# EAGLE design Arduino MEGA Reference Design (EAGLE 5.04)
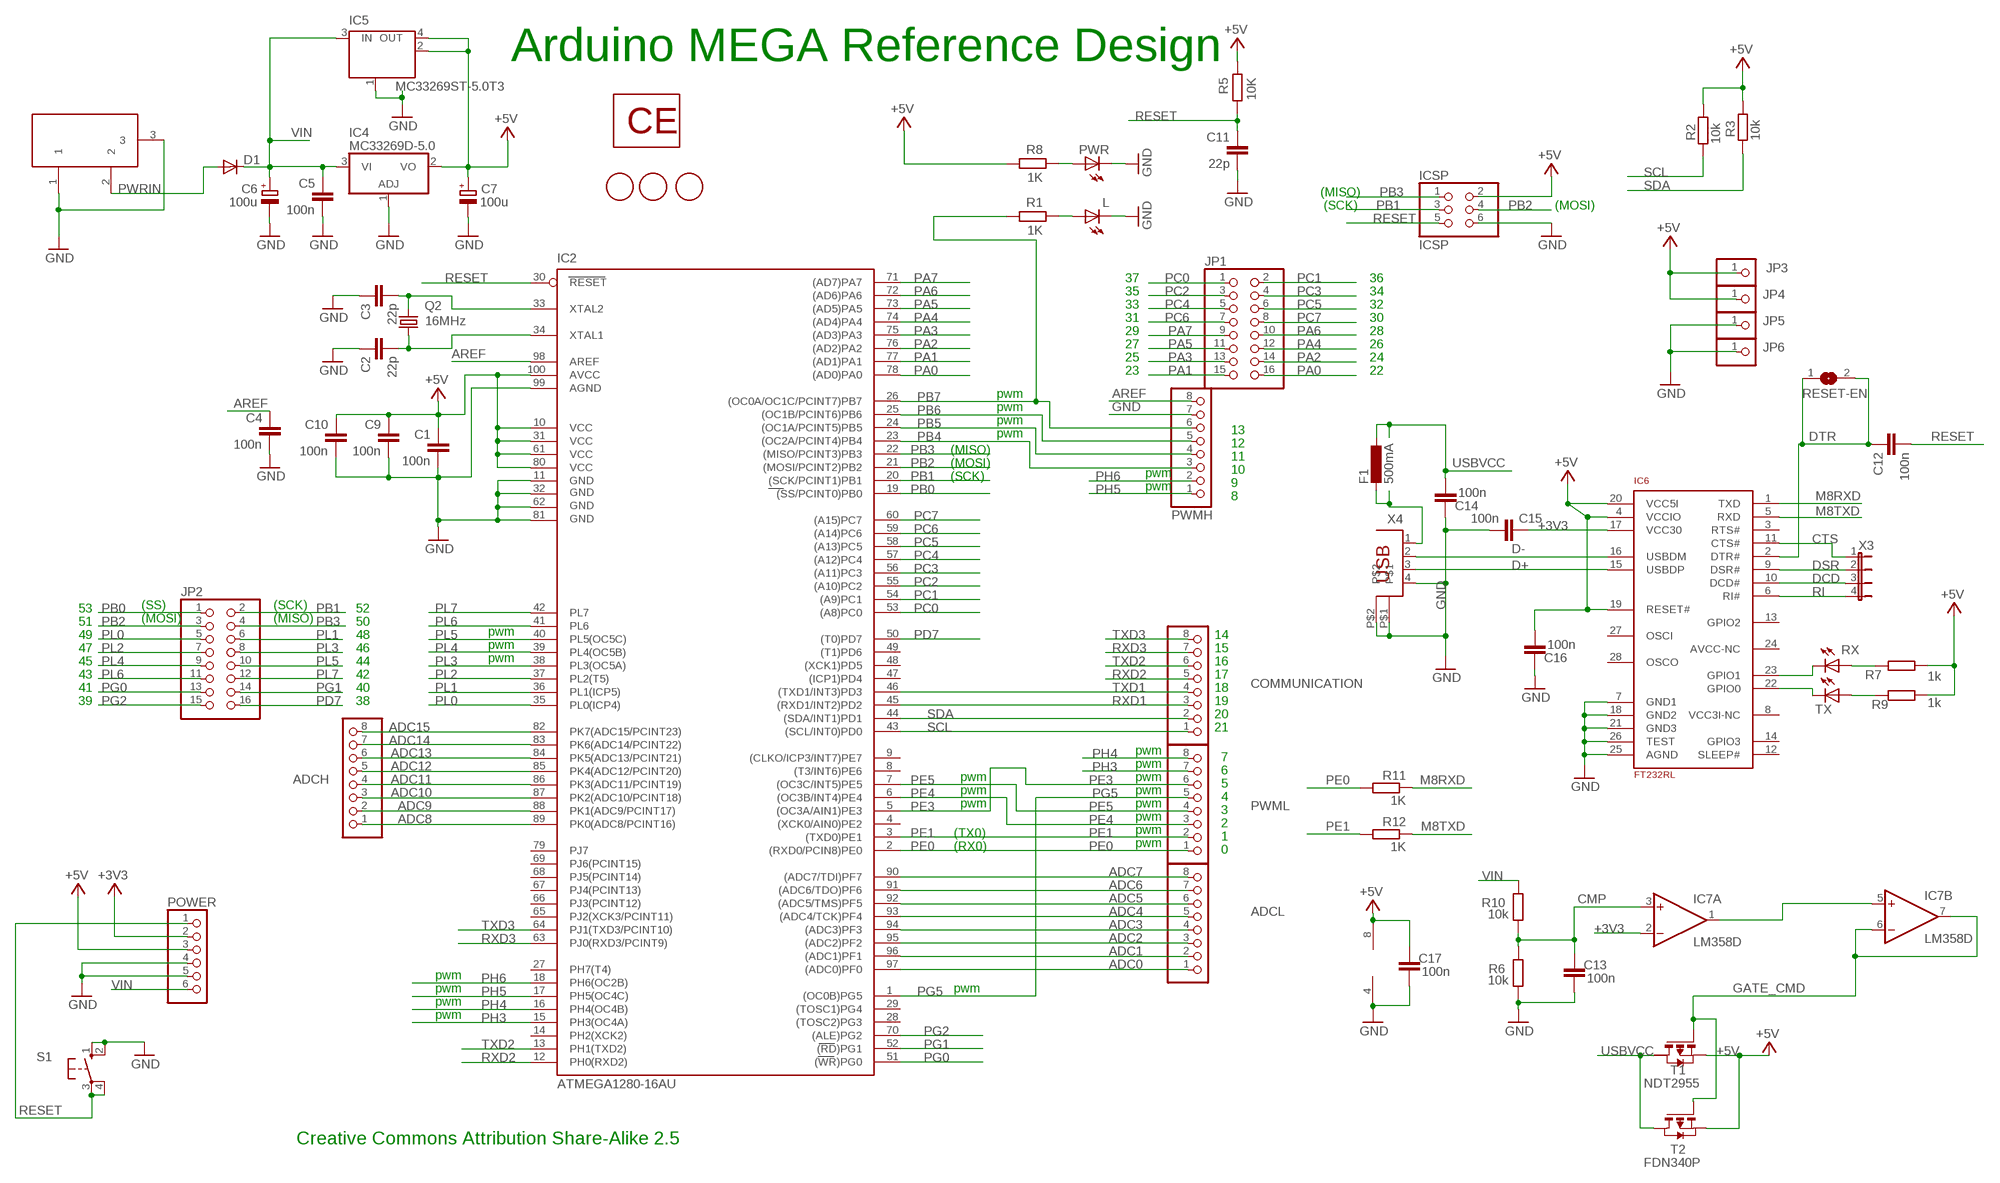
[diagram p0: schematic, sheet 1]

## Parts
ADCH  PINHD-1X8  [1X08]
ADCL  PINHD-1X8  [1X08]
C1  100n  C-EU  [C0805RND]
C2  22p  C-EU  [C0805RND]
C3  22p  C-EU  [C0805RND]
C4  100n  C-EU  [C0805RND]
C5  100n  C-EU  [C0805RND]
C6  100u  CPOL-EUSMCD  [SMC_D]
C7  100u  CPOL-EUSMCD  [SMC_D]
C9  100n  C-EU  [C0805RND]
C10  100n  C-EU  [C0805RND]
C11  22p  C-EU  [C0805RND]
C12  100n  C-EU  [C0805RND]
C13  100n  C-EU  [C0805RND]
C14  100n  C-EU  [C0805RND]
C15  100n  C-EU  [C0805RND]
C16  100n  C-EU  [C0805RND]
C17  100n  C-EU  [C0805RND]
COMMUNICATION  PINHD-1X8  [1X08]
D1  DIODE-SMB  [SMB]
F1  500mA  L-EUL1812  [L1812]
IC2  ATMEGA1280-16AU  [TQFP100]
IC4  MC33269D-5.0  [DPACK]
IC5  MC33269ST-5.0T3  MC33269ST-3.3T3  [SOT223]
IC6  FT232RL  [SSOP28]
IC7  LM358D  [SO08]
ICSP  ICSP  PINHD-2X3  [2X03]
JP1  PINHD-2X8  [2X08]
JP2  PINHD-2X8  [2X08]
JP3  PINHD-1X1  [1X01]
JP4  PINHD-1X1  [1X01]
JP5  PINHD-1X1  [1X01]
JP6  PINHD-1X1  [1X01]
L  LED0805ROUND  [0805RND]
POWER  PINHD-1X6  [1X06]
PWMH  PINHD-1X8  [1X08]
PWML  PINHD-1X8  [1X08]
PWR  LED0805ROUND  [0805RND]
Q2  16MHz  CRYTALHC49S  [HC49/S]
R1  1K  R-EU_  [R0805RND]
R2  10k  R-EU_  [R0805RND]
R3  10k  R-EU_  [R0805RND]
R5  10K  R-EU_  [R0805RND]
R6  10k  R-EU_  [R0805RND]
R7  1k  R-EU_  [R0805RND]
R8  1K  R-EU_  [R0805RND]
R9  1k  R-EU_  [R0805RND]
R10  10k  R-EU_  [R0805RND]
R11  1K  R-EU_  [RCL_0805RND]
R12  1K  R-EU_  [RCL_0805RND]
RESET-EN  SJ  [SJ]
RX  LED0805ROUND  [0805RND]
S1  10-XX  [B3F-10XX]
T1  NDT2955  PMOSSOT223  [SOT223]
T2  FDN340P  PMOSSOT23  [SOT-23]
TX  LED0805ROUND  [0805RND]
U$1  FIDUCIALMOUNT  [FIDUCIA-MOUNT]
U$2  FIDUCIALMOUNT  [FIDUCIA-MOUNT]
U$3  FIDUCIALMOUNT  [FIDUCIA-MOUNT]
U$4  CE  [CE-COPPER]
X2  DC21MMX  [DC-21MM]
X3  JP4E  [JP4]
X4  PN61729  [PN61729]

## Nets
+3V3 [power]: C15.2 IC6.17(VCC30) IC7.2(A:-IN) POWER.2
+5V [usbvcc]: C1.1 C7.+ C9.1 C10.1 C16.1 C17.2 IC2.10(VCC) IC2.31(VCC1) IC2.61(VCC2) IC2.80(VCC3) IC2.100(AVCC) IC4.2(VO) IC5.2(OUT) IC5.4(OUT) IC6.4(VCCIO) IC6.19(RESET#) IC6.20(VCC5I) IC7.8(P:V+) ICSP.2 JP3.1 JP4.1 POWER.3 R2.1 R3.1 R5.2 R7.2 R8.1 R9.2 T1.3(S) T2.2(S)
ADC0: ADCL.1 IC2.97((ADC0)PF0)
ADC1: ADCL.2 IC2.96((ADC1)PF1)
ADC2: ADCL.3 IC2.95((ADC2)PF2)
ADC3: ADCL.4 IC2.94((ADC3)PF3)
ADC4: ADCL.5 IC2.93((ADC4/TCK)PF4)
ADC5: ADCL.6 IC2.92((ADC5/TMS)PF5)
ADC6: ADCL.7 IC2.91((ADC6/TDO)PF6)
ADC7: ADCL.8 IC2.90((ADC7/TDI)PF7)
ADC8: ADCH.1 IC2.89(PK0(ADC8/PCINT16))
ADC9: ADCH.2 IC2.88(PK1(ADC9/PCINT17))
ADC10: ADCH.3 IC2.87(PK2(ADC10/PCINT18))
ADC11: ADCH.4 IC2.86(PK3(ADC11/PCINT19))
ADC12: ADCH.5 IC2.85(PK4(ADC12/PCINT20))
ADC13: ADCH.6 IC2.84(PK5(ADC13/PCINT21))
ADC14: ADCH.7 IC2.83(PK6(ADC14/PCINT22))
ADC15: ADCH.8 IC2.82(PK7(ADC15/PCINT23))
AREF: C4.1 IC2.98(AREF) PWMH.8
CMP: C13.2 IC7.3(A:+IN) R6.2 R10.1
CTS: IC6.11(CTS#) X3.1
D+: IC6.15(USBDP) X4.3
D-: IC6.16(USBDM) X4.2
DCD: IC6.10(DCD#) X3.3
DSR: IC6.9(DSR#) X3.2
DTR: C12.1 IC6.2(DTR#) RESET-EN.1 RESET-EN.2
GATE_CMD: IC7.6(B:-IN) IC7.7(B:OUT) T1.1(G) T2.3(G)
GND [gnd]: C1.2 C2.1 C3.1 C4.2 C5.2 C6.- C7.- C9.2 C10.2 C11.2 C13.1 C14.2 C15.1 C16.2 C17.1 IC2.11(GND) IC2.32(GND1) IC2.62(GND2) IC2.81(GND3) IC2.99(AGND) IC4.1(ADJ) IC5.1(GND/ADJ) IC6.7(GND1) IC6.18(GND2) IC6.21(GND3) IC6.25(AGND) IC6.26(TEST) IC7.4(P:V-) ICSP.6 JP5.1 JP6.1 L.P$2(C) POWER.4 POWER.5 PWMH.7 PWR.P$2(C) R6.1 S1.1(S) S1.2(S1) X2.1 X2.3 X4.4 X4.P$1 X4.P$2
M8RXD: IC6.1(TXD) R11.P$1
M8TXD: IC6.5(RXD) R12.P$1
N$2: L.P$1(A) R1.2
N$3: PWR.P$1(A) R8.2
N$4: IC7.1(A:OUT) IC7.5(B:+IN)
N$6: C2.2 IC2.34(XTAL1) Q2.1
N$7: C3.2 IC2.33(XTAL2) Q2.2
N$15: IC6.23(GPIO1) RX.P$2(C)
N$53: IC6.22(GPIO0) TX.P$2(C)
N$54: R7.1 RX.P$1(A)
N$55: R9.1 TX.P$1(A)
N$60 [usbvcc]: F1.2 X4.1
PA0: IC2.78((AD0)PA0) JP1.16
PA1: IC2.77((AD1)PA1) JP1.15
PA2: IC2.76((AD2)PA2) JP1.14
PA3: IC2.75((AD3)PA3) JP1.13
PA4: IC2.74((AD4)PA4) JP1.12
PA5: IC2.73((AD5)PA5) JP1.11
PA6: IC2.72((AD6)PA6) JP1.10
PA7: IC2.71((AD7)PA7) JP1.9
PB0: IC2.19((SS/PCINT0)PB0) JP2.1
PB1: IC2.20((SCK/PCINT1)PB1) ICSP.3 JP2.2
PB2: IC2.21((MOSI/PCINT2)PB2) ICSP.4 JP2.3
PB3: IC2.22((MISO/PCINT3)PB3) ICSP.1 JP2.4
PB4: IC2.23((OC2A/PCINT4)PB4) PWMH.3
PB5: IC2.24((OC1A/PCINT5)PB5) PWMH.4
PB6: IC2.25((OC1B/PCINT6)PB6) PWMH.5
PB7: IC2.26((OC0A/OC1C/PCINT7)PB7) PWMH.6 R1.1
PC0: IC2.53((A8)PC0) JP1.1
PC1: IC2.54((A9)PC1) JP1.2
PC2: IC2.55((A10)PC2) JP1.3
PC3: IC2.56((A11)PC3) JP1.4
PC4: IC2.57((A12)PC4) JP1.5
PC5: IC2.58((A13)PC5) JP1.6
PC6: IC2.59((A14)PC6) JP1.7
PC7: IC2.60((A15)PC7) JP1.8
PD7: IC2.50((T0)PD7) JP2.16
PE0: IC2.2((RXD0/PCIN8)PE0) PWML.1 R11.P$2
PE1: IC2.3((TXD0)PE1) PWML.2 R12.P$2
PE3: IC2.5((OC3A/AIN1)PE3) PWML.6
PE4: IC2.6((OC3B/INT4)PE4) PWML.3
PE5: IC2.7((OC3C/INT5)PE5) PWML.4
PG0: IC2.51((WR)PG0) JP2.13
PG1: IC2.52((RD)PG1) JP2.14
PG2: IC2.70((ALE)PG2) JP2.15
PG5: IC2.1((OC0B)PG5) PWML.5
PH3: IC2.15(PH3(OC4A)) PWML.7
PH4: IC2.16(PH4(OC4B)) PWML.8
PH5: IC2.17(PH5(OC4C)) PWMH.1
PH6: IC2.18(PH6(OC2B)) PWMH.2
PL0: IC2.35(PL0(ICP4)) JP2.5
PL1: IC2.36(PL1(ICP5)) JP2.6
PL2: IC2.37(PL2(T5)) JP2.7
PL3: IC2.38(PL3(OC5A)) JP2.8
PL4: IC2.39(PL4(OC5B)) JP2.9
PL5: IC2.40(PL5(OC5C)) JP2.10
PL6: IC2.41(PL6) JP2.11
PL7: IC2.42(PL7) JP2.12
PWRIN [power]: D1.A X2.2
RESET: C11.1 C12.2 IC2.30(RESET) ICSP.5 POWER.1 R5.1 S1.3(P) S1.4(P1)
RI: IC6.6(RI#) X3.4
RXD1: COMMUNICATION.3 IC2.45((RXD1/INT2)PD2)
RXD2: COMMUNICATION.5 IC2.12(PH0(RXD2))
RXD3: COMMUNICATION.7 IC2.63(PJ0(RXD3/PCINT9))
SCL: COMMUNICATION.1 IC2.43((SCL/INT0)PD0) R2.2
SDA: COMMUNICATION.2 IC2.44((SDA/INT1)PD1) R3.2
TXD1: COMMUNICATION.4 IC2.46((TXD1/INT3)PD3)
TXD2: COMMUNICATION.6 IC2.13(PH1(TXD2))
TXD3: COMMUNICATION.8 IC2.64(PJ1(TXD3/PCINT10))
USBVCC [usbvcc]: C14.1 F1.1 T1.2(D) T2.1(D)
VIN [power]: C5.1 C6.+ D1.C IC4.3(VI) IC5.3(IN) POWER.6 R10.2
Unconnected: IC2.4((XCK0/AIN0)PE2) IC2.8((T3/INT6)PE6) IC2.9((CLKO/ICP3/INT7)PE7) IC2.14(PH2(XCK2)) IC2.27(PH7(T4)) IC2.28((TOSC2)PG3) IC2.29((TOSC1)PG4) IC2.47((ICP1)PD4) IC2.48((XCK1)PD5) IC2.49((T1)PD6) IC2.65(PJ2(XCK3/PCINT11)) IC2.66(PJ3(PCINT12)) IC2.67(PJ4(PCINT13)) IC2.68(PJ5(PCINT14)) IC2.69(PJ6(PCINT15)) IC2.79(PJ7) IC6.3(RTS#) IC6.8(VCC3I-NC) IC6.12(SLEEP#) IC6.13(GPIO2) IC6.14(GPIO3) IC6.24(AVCC-NC) IC6.27(OSCI) IC6.28(OSCO) T1.4(D2)

## Notes on the sheet
- Arduino MEGA Reference Design
- (MISO)
- (SCK) | (MOSI)
- 37 | 36
- 35 | 34
- 33 | 32
- 31 | 30
- 29 | 28
- 27 | 26
- 25 | 24
- 23 | 22
- pwm
- pwm
- pwm
- pwm | 13
- 12
- (MISO)
- 11
- (MOSI)
- pwm | 10
- (SCK)
- pwm | 9
- 8
- 53 | (SS) | (SCK) | 52
- 51 | (MOSI) | (MISO) | 50
- 49 | 48 | pwm | 14
- 47 | 46 | pwm | 15
- 45 | 44 | pwm | 16
- 43 | 42 | 17
- 41 | 40 | 18
- 39 | 38 | 19
- 20
- 21
- pwm
- 7
- pwm
- 6
- pwm | pwm
- 5
- pwm | pwm
- 4
- pwm | pwm
- 3
- pwm
- 2
- (TX0) | pwm
- 1
- (RX0) | pwm
- 0
- pwm
- pwm | pwm
- pwm
- pwm
- Creative Commons Attribution Share-Alike 2.5

## Library data of the parts
ADCH ADCL COMMUNICATION PWMH PWML = pinhead:PINHD-1X8: PIN HEADER
C1-C5 C9-C17 = rcl:C-EU: CAPACITOR, European symbol
C6 C7 = rcl:CPOL-EU: POLARIZED CAPACITOR, European symbol
D1 = diode:DIODE-: DIODE
F1 = rcl:L-EU: INDUCTOR, European symbol
IC2 = atmel-2005:ATMEGA*: MICROCONTROLLER 64/128/256 Kbytes FLASH 4 Kbytes EEPROM 8 Kbytes SRAM 86 General Purpose I/O pins 12-channels16-bit PWM 4 x Serial USARTs 16-channels 10-bit A/D
IC4 = linear:MC33269?*: Adjustable Output Low Dropout Voltage Regulator 800 mA Source: http://www.onsemi.com/pub/Collateral/MC33269-D.PDF
IC5 = linear:MC33269ST*: Adjustable Output Low Dropout Voltage Regulator 800 mA Source: http://www.onsemi.com/pub/Collateral/MC33269-D.PDF
IC6 = SmartPrj:FT232RL
IC7 = linear:LM358: OP AMP also LM158; LM258; LM2904 Source: http://cache.national.com/ds/LM/LM158.pdf
ICSP = pinhead:PINHD-2X3: PIN HEADER
JP1 JP2 = pinhead:PINHD-2X8: PIN HEADER
JP3-JP6 = pinhead:PINHD-1X1: PIN HEADER
L PWR RX TX = led:LED: LED OSRAM: - CHIPLED LG R971, LG N971, LY N971, LG Q971, LY Q971, LO R971, LY R971 LH N974, LH R974 LS Q976, LO Q976, LY Q976 LO Q996 - Hyper CHIPLED LW Q18S LB Q993, LB Q99A, LB R99A - SideLED LS A670, LO A670, LY A670, LG A670, LP A670 LB A673, LV A673, LT A673, LW A673 LH A674 LY A675 LS A676, LA A676, LO A676, LY A676, LW A676 LS A679, LY A679, LG A679 - Hyper Micro SIDELED® LS Y876, LA Y876, LO Y876, LY Y876 LT Y87S - SmartLED LW L88C, LW L88S LB L89C, LB L89S, LG L890 LS L89K, LO L89K, LY L89K LS L896, LA L896, LO L896, LY L896 - TOPLED LS T670, LO T670, LY T670, LG T670, LP T670 LSG T670, LSP T670, LSY T670, LOP T670, LYG T670 LG T671, LOG T671, LSG T671 LB T673, LV T673, LT T673, LW T673 LH T674 LS T676, LA T676, LO T676, LY T676, LB T676, LH T676, LSB T676, LW T676 LB T67C, LV T67C, LT T67C, LS T67K, LO T67K, LY T67K, LW E67C LS E67B, LA E67B, LO E67B, LY E67B, LB E67C, LV E67C, LT E67C LW T67C LS T679, LY T679, LG T679 LS T770, LO T770, LY T770, LG T770, LP T770 LB T773, LV T773, LT T773, LW T773 LH T774 LS E675, LA E675, LY E675, LS T675 LS T776, LA T776, LO T776, LY T776, LB T776 LHGB T686 LT T68C, LB T68C - Hyper Mini TOPLED® LB M676 - Mini TOPLED Santana® LG M470 LS M47K, LO M47K, LY M47K Source: http://www.osram.convergy.de/
POWER = pinhead:PINHD-1X6: PIN HEADER
Q2 = crystal:CRYTAL: CRYSTAL
R1-R3 R5-R10 = rcl:R-EU_: RESISTOR, European symbol
R11 R12 = SmartPrj:R-EU_: RESISTOR, European symbol
RESET-EN = jumper:SJ: SMD solder JUMPER
S1 = switch-omron:10-XX: OMRON SWITCH
T1 = zetex:PMOSSOT223: MOS FET
T2 = zetex:PMOSSOT23: MOS FET
U$1-U$3 = SmartPrj:FIDUCIALMOUNT
U$4 = SmartPrj:CE
X2 = powersupply:DC21MM
X3 = jumper:JP4E: JUMPER
X4 = SmartPrj:PN61729: BERG USB connector

## Net classes
0 default: width 0.203 mm, drill 0.406 mm, clearance 0.203 mm
1 power: width 0.61 mm, drill 0.711 mm, clearance 0.203 mm
2 gnd: width 0.305 mm, drill 0.711 mm, clearance 0.203 mm
3 usbvcc: width 0.508 mm, drill 0.711 mm, clearance 0.203 mm

## Board
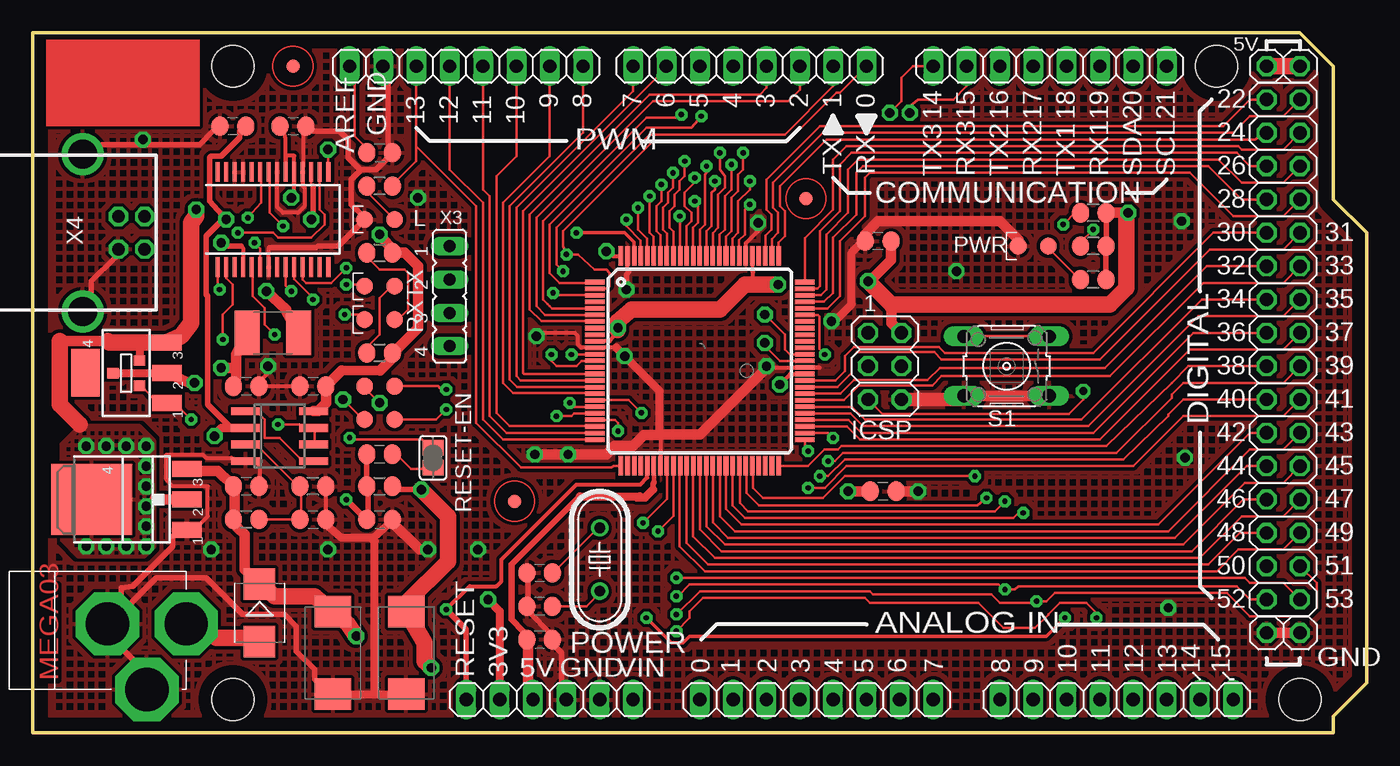
[diagram p1: board, top side]
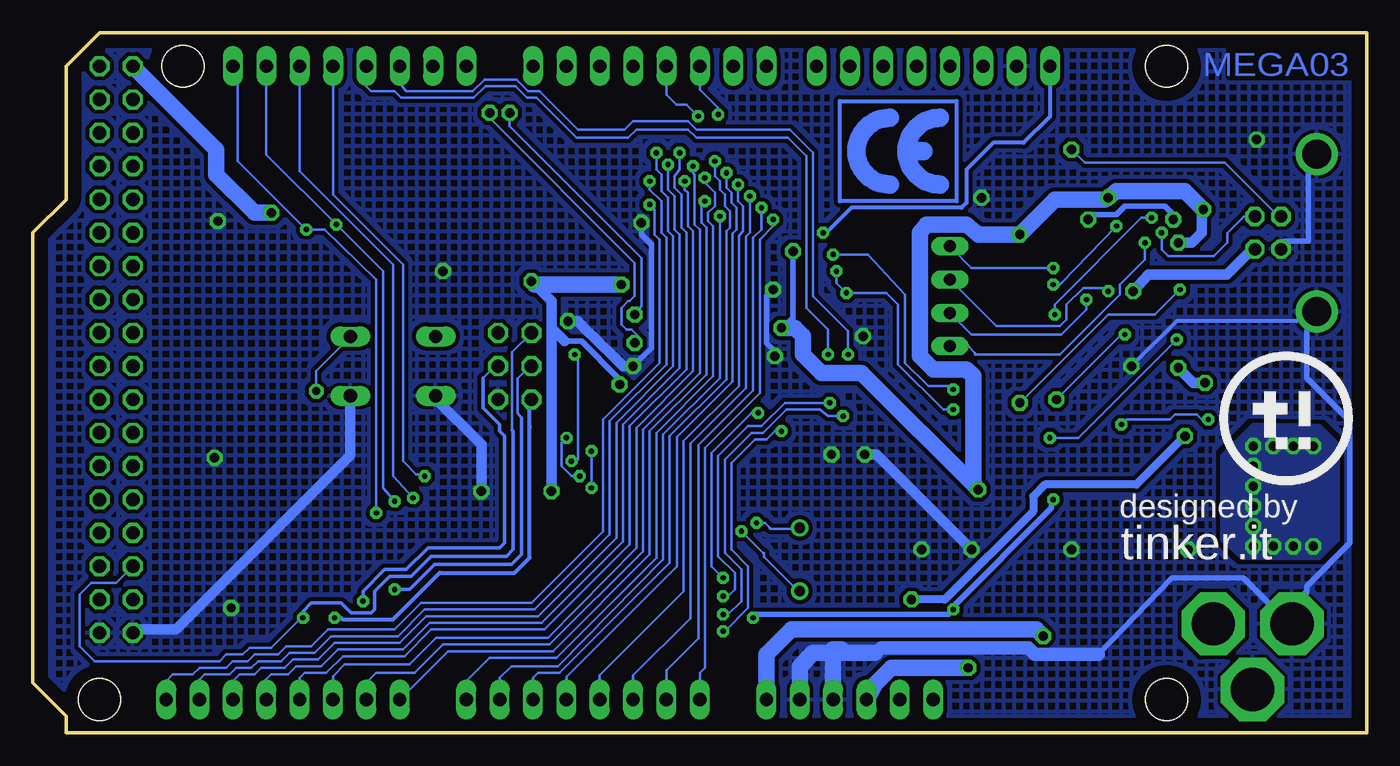
[diagram p2: board, bottom side, seen from below]

Size 101.6 x 53.34 mm. Coordinates in mm from the lower left corner, seen from the top.
Outline: 0,53.34 96.52,53.34 99.06,50.8 99.06,40.64 101.6,38.1 101.6,3.81 99.06,1.27 99.06,0 0,0 0,53.34
Copper layers (1*16): Top 0.035mm / dielectric 1.5mm / Bottom 0.035mm
Design rules "default *": minimum track width 8mil, minimum drill 16mil, track to track 8mil, track to pad 8mil, pad to pad 8mil, via to via 10mil, smd to smd 8mil, copper to edge 40mil, drill to drill 12mil, minimum pad ring 10mil, minimum via ring 10mil, stop-mask expansion 4mil, vias tented up to drill 0mil, thermal gap 10mil
Holes 3.2 mm at 96.52,2.54 15.24,50.8 90.17,50.8 15.24,2.54

### Footprints (pad centres in the part's own frame; a part is rotated, then mirrored left to right if it is on the bottom)
1X08 = drill 1.016 long: 1 -8.89,0; 2 -6.35,0; 3 -3.81,0; 4 -1.27,0; 5 1.27,0; 6 3.81,0; 7 6.35,0; 8 8.89,0
C0805RND = smd 1.3 x 1.5: 1 -0.977,0; 2 0.977,0
SMC_D = smd 2.4 x 2.8: + -3.15,0; - 3.15,0
SMB = smd 2.4 x 2.4: A 2.2,0; C -2.2,0
L1812 = smd 1.9 x 3.4: 1 -1.95,0; 2 1.95,0
TQFP100 = smd 1.5 x 0.35: 1 -8,6; 2 -8,5.5; 3 -8,5; 4 -8,4.5; 5 -8,4; 6 -8,3.5; 7 -8,3; 8 -8,2.5; 9 -8,2; 10 -8,1.5; 11 -8,1; 12 -8,0.5; 13 -8,0; 14 -8,-0.5; 15 -8,-1; 16 -8,-1.5; 17 -8,-2; 18 -8,-2.5; 19 -8,-3; 20 -8,-3.5; 21 -8,-4; 22 -8,-4.5; 23 -8,-5; 24 -8,-5.5; 25 -8,-6; 51 8,-6; 52 8,-5.5; 53 8,-5; 54 8,-4.5; 55 8,-4; 56 8,-3.5; 57 8,-3; 58 8,-2.5; 59 8,-2; 60 8,-1.5; 61 8,-1; 62 8,-0.5; 63 8,0; 64 8,0.5; 65 8,1; 66 8,1.5; 67 8,2; 68 8,2.5; 69 8,3; 70 8,3.5; 71 8,4; 72 8,4.5; 73 8,5; 74 8,5.5; 75 8,6 | smd 0.35 x 1.5: 26 -6,-8; 27 -5.5,-8; 28 -5,-8; 29 -4.5,-8; 30 -4,-8; 31 -3.5,-8; 32 -3,-8; 33 -2.5,-8; 34 -2,-8; 35 -1.5,-8; 36 -1,-8; 37 -0.5,-8; 38 0,-8; 39 0.5,-8; 40 1,-8; 41 1.5,-8; 42 2,-8; 43 2.5,-8; 44 3,-8; 45 3.5,-8; 46 4,-8; 47 4.5,-8; 48 5,-8; 49 5.5,-8; 50 6,-8; 76 6,8; 77 5.5,8; 78 5,8; 79 4.5,8; 80 4,8; 81 3.5,8; 82 3,8; 83 2.5,8; 84 2,8; 85 1.5,8; 86 1,8; 87 0.5,8; 88 0,8; 89 -0.5,8; 90 -1,8; 91 -1.5,8; 92 -2,8; 93 -2.5,8; 94 -3,8; 95 -3.5,8; 96 -4,8; 97 -4.5,8; 98 -5,8; 99 -5.5,8; 100 -6,8
DPACK = smd 1 x 1.6: 1 -2.28,-4.8; 3 2.28,-4.8 | smd 5.4 x 6.2: 2 0,2.5
SOT223 = smd 1.219 x 2.235: 1 -2.311,-3.099; 2 0,-3.099; 3 2.311,-3.099 | smd 3.6 x 2.2: 4 0,3.099
SSOP28 = smd 0.381 x 1.499: 1 -4.225,-3.625; 2 -3.575,-3.625; 3 -2.925,-3.625; 4 -2.275,-3.625; 5 -1.625,-3.625; 6 -0.975,-3.625; 7 -0.325,-3.625; 8 0.325,-3.625; 9 0.975,-3.625; 10 1.625,-3.625; 11 2.275,-3.625; 12 2.925,-3.625; 13 3.575,-3.625; 14 4.225,-3.625; 15 4.225,3.625; 16 3.575,3.625; 17 2.925,3.625; 18 2.275,3.625; 19 1.625,3.625; 20 0.975,3.625; 21 0.325,3.625; 22 -0.325,3.625; 23 -0.975,3.625; 24 -1.625,3.625; 25 -2.275,3.625; 26 -2.925,3.625; 27 -3.575,3.625; 28 -4.225,3.625
SO08 = smd 0.6 x 2.2: 1 -1.905,-2.6; 2 -0.635,-2.6; 3 0.635,-2.6; 4 1.905,-2.6; 5 1.905,2.6; 6 0.635,2.6; 7 -0.635,2.6; 8 -1.905,2.6
2X03 = drill 1.016 octagon: 1 -2.54,-1.27; 2 -2.54,1.27; 3 0,-1.27; 4 0,1.27; 5 2.54,-1.27; 6 2.54,1.27
2X08 = drill 1.016 octagon: 1 -8.89,-1.27; 2 -8.89,1.27; 3 -6.35,-1.27; 4 -6.35,1.27; 5 -3.81,-1.27; 6 -3.81,1.27; 7 -1.27,-1.27; 8 -1.27,1.27; 9 1.27,-1.27; 10 1.27,1.27; 11 3.81,-1.27; 12 3.81,1.27; 13 6.35,-1.27; 14 6.35,1.27; 15 8.89,-1.27; 16 8.89,1.27
1X01 = drill 1.016 octagon: 1 0,0
0805RND = smd 1.27 x 1.27: P$1 -1.143,0; P$2 1.143,0
1X06 = drill 1.016 long: 1 -6.35,0; 2 -3.81,0; 3 -1.27,0; 4 1.27,0; 5 3.81,0; 6 6.35,0
HC49/S = drill 0.813 round: 1 -2.413,0; 2 2.413,0
R0805RND = smd 1.3 x 1.5: 1 -0.977,0; 2 0.977,0
RCL_0805RND = smd 1.27 x 1.27: P$1 -1.143,0; P$2 1.143,0
SJ = smd 1.168 x 1.6: 1 -0.762,0; 2 0.762,0
B3F-10XX = drill 1.016 long: 1 -3.251,2.261; 2 3.251,2.261; 3 -3.251,-2.261; 4 3.251,-2.261
SOT-23 = smd 0.787 x 0.889: 1 0.025,-1.016; 2 -0.94,1.016; 3 0.991,1.016
FIDUCIA-MOUNT = smd 1.016 x 1.016: P$1 0,0
DC-21MM = drill 3.302 pad 4.826 octagon: 1 -5.08,-3.353; 2 -0.076,-6.35; 3 -0.076,-0.356
JP4 = drill 0.914 long: 1 -3.81,0; 2 -1.27,0; 3 1.27,0; 4 3.81,0
PN61729 = drill 0.95 octagon: 1 1.25,4.71; 2 -1.25,4.71; 3 -1.25,2.71; 4 1.25,2.71 | drill 2.2 round: P$1 -6,0; P$2 6,0

### Placement (x,y rotation side)
ADCH  82.55,2.54 0 top
ADCL  59.69,2.54 0 top
C1  64.77,18.41 0 top
C2  38.61,9.65 0 top
C3  38.61,12.19 0 top
C4  26.42,44.2 0 top
C5  16.26,18.8 0 top
C6  22.86,6.1 270 top
C7  28.45,6.1 270 top
C9  64.39,37.47 180 top
C10  38.61,7.11 0 top
C11  26.42,16.26 0 top
C12  26.42,21.23 180 top
C13  21.34,16.26 180 top
C14  16.26,26.42 0 top
C15  15.24,46.23 0 top
C16  19.81,46.23 0 top
C17  21.34,26.42 0 top
COMMUNICATION  77.47,50.8 180 top
D1  17.27,9.14 270 top
F1  18.29,30.48 0 top
IC2  50.8,28.35 0 top
IC4  6.99,17.78 90 top
IC5  8.64,17.78 90 top
IC6  18.29,39.12 0 top
IC7  18.8,22.61 270 top
ICSP  64.9,27.94 270 top
JP1  95.25,39.37 90 top
JP2  95.25,19.05 90 top
JP3  93.98,50.8 0 top
JP4  96.52,50.8 0 top
JP5  93.98,7.62 0 top
JP6  96.52,7.62 0 top
L  26.42,39.12 180 top
POWER  39.37,2.54 0 top
PWMH  33.02,50.8 180 top
PWML  54.61,50.8 180 top
PWR  76.2,37.08 180 top
Q2  43.18,13.21 90 top
R1  26.42,41.66 180 top
R2  80.77,37.08 180 top
R3  80.77,39.62 180 top
R5  26.42,18.8 0 top
R6  21.34,18.8 180 top
R7  26.42,36.58 0 top
R8  80.77,34.54 180 top
R9  26.42,28.96 0 top
R10  16.26,16.26 180 top
R11  26.42,26.42 0 top
R12  26.42,23.88 0 top
RESET-EN  30.48,20.95 270 top
RX  26.42,31.5 180 top
S1  74.17,27.94 180 top
T1  7.11,27.43 90 top
T2  7.11,27.43 270 top
TX  26.42,34.04 180 top
U$1  58.9,40.72 0 top
U$2  36.7,17.65 0 top
U$3  19.81,50.8 0 top
U$4  40.13,40.51 0 bottom
X2  5.33,8.38 90 top
X3  31.75,33.27 270 top
X4  3.81,38.1 270 top

### Tracks (layer width: path | path; a pad name or v marks a point on that pad's centre or on a via)
+3V3  (via drill 0.71)
  Top 0.203: 21.34,41.66 21.21,41.78 21.21,42.04 IC6.17 | 15.75,45.85 C15.2
  Top 0.406: v21.21,39.12 21.34,39.24 21.34,41.66 | 15.75,45.85 15.75,45.34 14.35,43.94 13.59,43.94 13.46,43.81 13.46,40.51 v14.73,39.12 14.48,39.12 13.21,37.85 13.21,33.4 13.34,33.27 13.34,25.02 15.11,23.24 16.13,23.24
  Top 0.61: POWER.2 35.56,9.27 v34.67,10.16 | v13.84,22.61 13.84,22.73 14.35,23.24 16.13,23.24 IC7.2
  Bottom 0.203: v14.73,39.12 14.73,39.5
  Bottom 0.406: 14.73,39.5 15.37,40.13 18.41,40.13 19.05,39.5 20.83,39.5 v21.21,39.12
  Bottom 0.61: v34.67,10.16 32.13,10.16 25.4,16.89 25.4,18.03 24.51,18.92 17.53,18.92 v13.84,22.61
+5V  (via drill 0.71)
  Top 0.203: 46,17.93 46.15,17.96 46.23,18.03
  Top 0.254: IC2.80 54.81,36.3 54.79,36.27 54.81,36.25 54.81,35.41 | 57.66,27.3 57.7,27.35
  Top 0.305: C16.1 19.18,45.59 19.25,45.31 19.25,44.02 IC6.20 19.25,43.97 19.91,43.97 IC6.19 19.91,41.91 19.91,41.27 v19.68,40.77 | IC2.10 43.94,29.85 44.45,30.48 | IC6.4 16.01,36.95 15.88,37.08 | 54.86,34.67 54.86,35.1 54.81,35.15 54.81,35.41 | 57.7,27.35 IC2.61 | v56.9,26.54 57.66,27.3 | IC2.100 44.17,36.35 v43.69,36.7
  Top 0.356: 47.3,19.11 IC2.31
  Top 0.406: 44.55,30.7 44.45,30.48 v44.58,30.86 | 15.88,37.08 14.61,37.08 v14.35,37.34 | v56.77,34.16 55.37,34.16 54.86,34.67 | R8.1 81.75,37.05 81.79,37.08 R2.1 81.66,37.08 81.79,37.21 81.79,39.5 81.66,39.62 R3.1 | R5.2 27.43,18.8 27.69,18.54 v29.59,18.54 | 47.24,18.54 47.24,18.92 47.3,19.11
  Top 0.508: 3.56,23.5 3.56,23.37 | 41.66,18.03 36.45,12.83 36.45,8.64 37.34,7.75 C10.1
  Top 0.61: 41.66,18.03 46.23,18.03 | 46,17.93 46.63,17.93 47.24,18.54 | T2.2 8.13,29.23 7.62,29.74
  Top 0.711: 26.44,27.61 23.52,27.61
  Top 0.813: 9.27,17.78 IC5.2 | 2.03,29.84 5.71,29.84 | v26.42,37.97 27.05,37.21 R7.2 28.32,36.58 29.34,35.56 29.34,30.86 27.43,28.96 | C10.1 37.72,6.48 37.72,3.94 POWER.3 | R3.1 v83.44,39.62 83.31,39.5 | v62.1,18.41 C1.1 | v63.63,34.42 63.75,34.42 65.37,36.03 C9.1 | 83.31,35.31 83.31,35.18 | 27.39,29 27.3,29.08 27.3,28.45 26.44,27.61 | 27.39,29 R9.2 27.43,28.96 | 27.43,28.96 27.39,29 | 23.52,27.61 22.35,26.42 | IC7.8 21.72,24.51 22.35,25.15 22.35,26.42 | 22.35,26.42 C17.2 | 65.41,32.64 65.41,31.24 ICSP.2
  Top 1.27: 3.56,23.5 2.03,25.02 2.03,29.84 | v12.45,39.88 12.45,39.37 12.06,38.86 12.06,31.24 11.3,30.23 T1.3 7.62,29.74 5.82,29.74 5.71,29.84 | v30.35,4.95 29.84,5.46 29.84,6.86 C7.+ 28.45,9.91 31.62,13.08 31.62,16.51 v29.59,18.54 | JP3.1 JP4.1 | v63.63,34.42 65.41,32.64 82.04,32.64 83.31,33.91 83.31,35.31 83.31,39.5 | 44.55,30.7 44.55,31.34 45.59,32.26 52.32,32.26 54.23,34.16 v56.77,34.16
  Bottom 0.406: v44.58,30.86 44.58,30.73 43.69,31.62 v43.69,36.7 | 61.09,29.84 59.82,29.84 57.02,27.05 57.02,26.67 v56.9,26.54
  Bottom 0.61: 63.37,34.16 v63.63,34.42
  Bottom 0.813: v14.35,37.34 13.34,37.34 12.57,38.1 12.57,39.88 12.7,40.01 v12.45,39.88 | v29.59,18.54 29.59,18.67 29.97,19.05 | 61.09,29.84 62.1,30.86 62.1,31.11 | 62.1,31.11 62.1,32.89 v63.63,34.42 | 62.1,31.11 v62.1,18.41
  Bottom 1.27: v12.45,39.88 13.84,41.27 19.05,41.27 v19.68,40.77 19.94,40.64 23.75,40.64 v26.42,37.97 29.59,37.97 30.48,38.73 33.53,38.73 34.04,38.1 34.04,28.7 33.02,27.69 30.48,27.69 29.97,27.18 29.97,19.05 | v30.35,4.95 36.2,4.95 37.47,3.68 POWER.3 | v56.77,34.16 63.37,34.16 | v29.59,18.54 38.48,27.43 41.53,27.43 42.93,28.83 42.93,30.23 43.56,30.86 v44.58,30.86 | v83.44,39.62 84.71,39.62 87.63,42.55 87.63,44.45 JP3.1
  other vias: 4.06,21.84 8.64,21.84 7.11,21.84 5.59,21.84 8.64,20.32 8.64,18.8 4.06,14.22 5.59,14.22 7.11,14.22 8.64,15.75 8.64,17.27 8.64,14.22
  pour Top (isolate 0.305, hatched): 8.51,13.46 9.27,14.22 9.27,22.23 8.13,23.37 3.56,23.37 2.16,21.97 2.16,14.73 3.43,13.46
  pour Bottom: 2.16,14.73 2.16,21.97 3.56,23.37 8.64,23.5 11.05,21.08 11.05,14.73 9.53,13.34 3.56,13.34
ADC0  (via drill 0.41)
  Top 0.203: IC2.97 46.3,37.52 45.21,38.61 v45.21,39.12
  Bottom 0.203: ADCL.1 50.8,4.57 50.42,4.95 50.42,21.72 46.23,25.91 46.23,37.59 45.21,38.61 v45.21,39.12
ADC1  (via drill 0.41)
  Top 0.203: IC2.96 46.8,37.66 46.1,38.35 v46.1,40.01
  Bottom 0.203: ADCL.2 53.34,4.78 50.9,7.21 50.9,21.92 46.74,26.09 46.74,37.72 46.1,38.35 v46.1,40.01
ADC2  (via drill 0.41)
  Top 0.203: v46.99,40.89 46.99,38.1 47.27,37.82 47.27,36.68 47.37,36.58 47.3,36.51 47.3,36.38 47.27,36.35 | 47.27,36.35 47.24,36.32 | 47.27,36.35 IC2.95
  Bottom 0.203: ADCL.3 55.88,4.37 51.51,8.74 51.51,8.76 51.49,8.79 51.49,22.05 47.27,26.26 47.27,37.82 46.99,38.1 v46.99,40.89
ADC3  (via drill 0.41)
  Top 0.203: IC2.94 47.8,37.92 47.5,38.23 47.5,40.13 47.88,40.51 v47.88,41.78
  Bottom 0.203: ADCL.4 58.42,2.74 58.52,2.85 58.52,3.05 58.42,3.15 58.42,4.37 52.02,10.77 52.02,22.23 47.8,26.44 47.8,37.85 47.75,37.97 47.5,38.23 47.5,40.13 47.88,40.51 v47.88,41.78
ADC4  (via drill 0.41)
  Top 0.203: IC2.93 48.3,38.06 48.01,38.35 48.01,40.01 48.39,40.39 48.39,41.15 48.77,41.53 v48.77,42.67
  Bottom 0.203: 60.96,2.44 ADCL.5 60.96,4.27 52.53,12.7 52.53,22.55 48.31,26.77 48.31,38.05 48.01,38.35 48.01,40.01 48.39,40.39 48.39,41.15 48.77,41.53 v48.77,42.67
ADC5  (via drill 0.41)
  Top 0.203: IC2.92 48.8,38.2 48.51,38.48 48.51,39.75 48.9,40.13 48.9,41.02 49.28,41.4 49.28,42.04 49.66,42.42 v49.66,43.56
  Bottom 0.203: ADCL.6 63.5,2.41 63.63,2.54 63.63,3.05 63.5,3.17 63.5,4.19 63.12,4.57 61.47,4.57 53.09,12.95 53.09,22.61 48.77,26.92 48.77,38.23 48.51,38.48 48.51,39.75 48.9,40.13 48.9,41.02 49.28,41.4 49.28,42.04 49.66,42.42 v49.66,43.56
ADC6  (via drill 0.41)
  Top 0.203: IC2.91 49.3,39.35 v49.28,39.37
  Bottom 0.203: v49.28,39.37 49.28,27.05 53.59,22.73 53.59,13.21 61.59,5.08 65.15,5.08 66.04,4.19 ADCL.7
ADC7  (via drill 0.41)
  Top 0.203: IC2.90 49.8,38.62 50.16,38.99 50.16,39.62 49.66,40.13 49.66,41.15 50.42,41.91 v50.42,42.29
  Bottom 0.203: v50.42,42.29 50.42,41.91 49.66,41.15 49.66,40.13 50.16,39.62 50.16,38.99 49.78,38.61 49.78,27.18 54.1,22.86 54.1,13.34 61.72,5.71 66.8,5.71 68.58,3.94 ADCL.8
ADC8  (via drill 0.41)
  Top 0.203: IC2.89 50.3,38.49 50.67,38.86 50.67,40.26 v50.42,40.51
  Bottom 0.203: v50.42,40.51 50.67,40.26 50.67,38.86 50.29,38.48 50.29,27.3 54.61,22.99 54.61,13.59 61.98,6.22 69.98,6.22 ADCH.1
ADC9  (via drill 0.41)
  Top 0.203: IC2.88 50.8,38.35 51.18,38.73 51.18,42.55 51.31,42.67 v51.31,43.18
  Bottom 0.203: v51.31,43.18 51.31,42.67 51.18,42.55 51.18,38.73 50.8,38.35 50.8,27.43 55.12,23.11 55.12,13.84 62.23,6.73 70.36,6.73 72.52,4.57 75.44,4.57 76.2,3.81 ADCH.2
ADC10  (via drill 0.41)
  Top 0.203: IC2.87 51.3,38.22 51.69,38.61 51.69,41.15 51.94,41.4 v51.94,42.04
  Bottom 0.203: v51.94,42.04 51.94,41.4 51.69,41.15 51.69,38.61 51.31,38.23 51.31,27.56 55.63,23.24 55.63,14.1 62.36,7.24 70.87,7.24 72.9,5.21 77.85,5.21 78.74,4.32 ADCH.3
ADC11  (via drill 0.41)
  Top 0.203: IC2.86 51.8,38.08 52.2,38.48 52.2,41.02 52.7,41.53 52.7,42.42 52.32,42.93 v52.32,44.2
  Bottom 0.203: v52.32,44.2 52.32,42.93 52.7,42.42 52.7,41.53 52.2,41.02 52.2,38.48 51.82,38.1 51.82,27.69 56.13,23.37 56.13,14.35 62.61,7.87 71.25,7.87 73.28,5.84 77.98,5.84 79.25,4.57 80.9,4.57 81.28,4.19 81.28,2.67 81.41,2.54 | 81.41,2.54 81.53,2.41 | 81.41,2.54 ADCH.4
ADC12  (via drill 0.41)
  Top 0.203: IC2.85 52.3,37.95 52.7,38.35 52.7,40.89 53.21,41.4 v53.21,43.31
  Bottom 0.203: v53.21,43.31 53.21,41.4 52.7,40.89 52.7,38.35 52.32,37.97 52.32,27.81 56.64,23.5 56.64,14.61 62.87,8.38 71.37,8.38 73.41,6.35 78.36,6.35 79.63,5.08 81.53,5.08 82.17,4.45 83.44,4.45 83.82,4.06 83.82,2.79 83.95,2.67 ADCH.5
ADC13  (via drill 0.41)
  Top 0.203: IC2.84 52.8,37.81 53.21,38.23 53.21,40.77 53.72,41.27 53.72,42.55 54.1,42.93 v54.1,44.2
  Bottom 0.203: v54.1,44.2 54.1,42.93 53.72,42.55 53.72,41.27 53.21,40.77 53.21,38.23 52.83,37.85 52.83,27.94 57.15,23.62 57.15,14.86 63.12,8.89 71.63,8.89 73.66,6.86 78.61,6.86 79.88,5.59 81.79,5.59 82.42,4.95 84.2,4.95 84.71,4.45 85.85,4.45 86.36,3.94 ADCH.6
ADC14  (via drill 0.41)
  Top 0.203: IC2.83 53.3,37.68 53.72,38.1 53.72,40.51 54.61,41.4 v54.61,42.04
  Bottom 0.203: v54.61,42.04 54.61,41.4 53.72,40.51 53.72,38.1 53.34,37.72 53.34,28.07 57.66,23.75 57.66,15.11 63.37,9.4 71.75,9.4 73.79,7.37 78.87,7.37 80.14,6.1 82.04,6.1 82.68,5.46 84.45,5.46 84.96,4.95 86.11,4.95 86.61,4.45 88.52,4.45 88.9,4.06 ADCH.7
ADC15  (via drill 0.41)
  Top 0.203: IC2.82 53.8,37.54 54.23,37.97 54.23,39.88 v54.61,40.26
  Bottom 0.203: v54.61,40.26 54.23,39.88 54.23,37.97 53.85,37.59 53.85,28.19 58.17,23.88 58.17,15.37 63.63,9.91 72.01,9.91 74.04,7.87 79.12,7.87 80.39,6.6 82.3,6.6 82.93,5.97 84.71,5.97 85.22,5.46 86.36,5.46 86.87,4.95 88.9,4.95 89.41,4.45 90.93,4.45 91.44,3.94 ADCH.8
AREF  (via drill 0.41)
  Top 0.203: C4.1 25.15,44.83 24.51,45.47 24.51,49.4 PWMH.8
  Top 0.254: IC2.98 45.8,37.38 45.09,38.1 v41.4,38.1
  Bottom 0.305: v41.4,38.1 41.15,38.1 39.24,40.01 30.86,40.01 30.48,40.39 30.48,42.93 28.45,44.96 26.13,44.96 24.13,46.96 24.13,50.55 23.88,50.8 PWMH.8
CMP
  Top 0.203: R10.1 C13.2 20.45,16.89 20.45,18.16 R6.2 19.81,19.18 17.27,21.72 IC7.3
CTS  (via drill 0.41)
  Top 0.203: IC6.11 20.56,34.55 20.83,34.29 22.73,34.29 v23.88,35.43
  Bottom 0.203: 31.88,37.21 X3.1 30.1,35.43 v23.88,35.43
D+  (via drill 0.71)
  Top 0.203: v22.48,44.45 22.48,43.43 IC6.15
  Bottom 0.203: v22.48,44.45 21.46,43.43 10.79,43.43 6.99,39.62 X4.3
D-  (via drill 0.41)
  Top 0.203: IC6.16 21.84,42.04 21.84,39.88 22.23,39.5 22.23,38.73 21.21,37.72 18.67,37.72 18.29,38.1 v15.62,38.1
  Bottom 0.203: X4.2 9.35,39.35 10.62,38.08 10.62,37.36 11.66,36.32 12.19,36.32 15.11,36.32 15.62,36.83 v15.62,38.1
DCD  (via drill 0.41)
  Top 0.203: IC6.10 19.91,34.57 21.34,33.15 v21.34,33.02
  Bottom 0.203: v21.34,33.02 21.34,32.26 23.24,30.35 30.1,30.35 X3.3
DSR  (via drill 0.41)
  Top 0.203: IC6.9 19.26,34.08 v19.68,33.66
  Bottom 0.203: v19.68,33.66 19.94,33.91 21.59,33.91 22.86,32.64 22.86,31.5 23.37,30.99 28.19,30.99 X3.2
DTR  (via drill 0.41)
  Top 0.203: v14.48,29.97 14.48,31.88 15.24,32.64 15.24,34.16 14.73,34.67 14.73,34.8 IC6.2 | C12.1 27.69,21.23 28.8,20.12 30.38,20.12 30.48,20.22 | 30.48,20.22 30.53,20.27 30.53,21.64 30.45,21.72 | 30.48,20.22 RESET-EN.2 | 30.45,21.72 30.43,21.74 | 30.45,21.72 RESET-EN.1 30.48,21.54 29.82,22.2 29.67,22.35 24.64,22.35 24.51,22.48 v24.13,22.48
  Bottom 0.203: v14.48,29.97 21.97,22.48 v24.13,22.48
GATE_CMD  (via drill 0.41)
  Top 0.203: IC7.6 21.46,22.23 21.46,22.99 IC7.7 20.32,23.5 v18.67,23.5 | T2.3 8.51,26.16 9.14,25.53 T1.1 11.3,24.64 v12.06,23.88
  Bottom 0.203: v18.67,23.5 18.29,23.88 14.99,23.88 14.61,24.26 12.95,24.26 12.57,23.88 v12.06,23.88
GND  (via drill 0.71)
  Top 0.305: 24.96,42.86 25.02,42.93 | 21.34,45.85 C16.2 20.57,45.59 20.57,43.43 IC6.18 20.56,41.67 20.7,41.53 20.7,40.13 20.19,39.62 19.05,39.62 18.62,40.06 18.62,42.6 18.61,42.6 IC6.21 | C17.1 C14.2 17.53,27.05 17.91,27.43 v17.91,27.94 | 13.72,45.85 C15.1 | C5.2 17.27,19.43 17.27,20.45 IC7.4 15.11,20.95 13.21,20.95 12.95,21.21 10.16,21.21 10.16,19.3 10.67,18.8 13.34,18.8 13.34,16.51 12.83,16 IC5.1 | IC4.1 11.81,15.49 IC5.1 | 10.67,14.99 IC5.1 | C13.1 22.35,16.89 22.35,18.16 R6.1 | 27.18,16 C11.2 | C6.- 24.26,2.92 | C2.1 37.72,10.29 | 37.72,11.56 C3.1 | C10.2 39.24,7.75 | 45.39,35.1 45.29,35.2 IC2.99 | 44.32,29.36 42.88,29.36 42.86,29.35 IC2.11 41.77,29.35 41.53,29.59 41.53,30.23 41.27,30.48 38.61,30.48 v38.35,30.23 | 44.32,29.36 44.4,29.36 | 56.06,27.86 56.08,27.84 59.92,27.84 | 58.83,27.84 58.82,27.85 IC2.62 58.81,27.84 59.92,27.84 | IC6.7 17.96,36.89 18.03,36.96 | IC2.32 47.8,22.68 47.75,22.73 | IC2.81 54.3,37.28 55.24,38.23 v55.24,38.86 | 44.32,29.36 44.32,29.34 44.35,29.36 44.42,29.36 | 59.92,27.84 59.94,27.81
  Top 0.406: 25.02,42.93 26.16,42.93 26.92,43.69 C4.2 27.05,44.83 27.05,49.4 PWMH.7 | 21.34,45.85 23.37,45.85 24,45.21 24,43.81 24.96,42.86 24.26,42.16 24.26,40.26 24.89,39.62 L.P$2 23.24,37.08 21.72,37.08 21.59,36.96 18.03,36.96 | X4.4 6.22,36.2 4.45,34.42 4.45,33.66 X4.P$2 | 13.72,45.85 12.7,44.83 5.33,44.83 X4.P$1 | 10.67,14.99 10.67,14.22 7.62,11.18 6.73,11.05 6.73,10.67 X2.3 | C6.- 21.46,4.06 21.46,4.83 20.07,6.22 20.07,8.13 19.18,9.02 16,9.02 13.21,11.81 9.4,11.81 5.84,8.26 5.79,8.31 X2.3 | X2.3 6.99,6.22 7.62,5.59 X2.1 | 37.72,10.29 37.72,11.56 | 39.24,7.75 37.97,9.02 C2.1 | C10.2 39.88,6.48 40.26,6.1 40.26,3.94 POWER.4 | 56.06,27.86 56.01,27.81 v55.88,27.94 | v45.21,33.78 45.21,34.92 45.39,35.1
  Top 0.61: 27.18,16 25.91,14.86 25.78,14.86 | 25.78,14.86 23.5,14.86 22.61,15.62 C13.1 | 26.04,2.92 27.05,2.92 C7.- | 24.26,2.92 26.04,2.92 | 25.78,14.86 26.04,14.61 26.04,2.92 | 55.88,27.81 v55.88,27.94 | 47.75,22.73 47.75,26.04 v45.09,28.7 44.42,29.36 | 63.37,37.47 63.25,37.47 62.36,36.58 62.36,32.64 61.09,31.37 v60.83,31.37
  Top 0.813: JP5.1 JP6.1 | 47.75,22.73 50.8,22.73 55.88,27.81 | C1.2 v67.44,18.41 | PWR.P$2 75.06,37.59 73.66,38.99 64.39,38.99 63.37,37.97 63.37,37.47 C9.2 | 77.44,25.68 S1.1 | S1.2 77.44,25.68 | 77.44,25.68 77.47,25.65 | 47.8,22.68 46.56,22.68 45.72,21.84 44.32,21.84 43.69,21.21 v38.23,21.21 | C11.2 27.39,16.22 27.3,16.13 29.46,13.97 v30.1,13.97
  Top 1.016: S1.2 70.89,25.68 70.61,25.4 ICSP.6
  Bottom 0.305: v17.91,27.94 14.48,31.37 5.33,31.37 X4.P$2 | 4.7,10.67 4.57,10.67
  Bottom 0.406: X4.P$1 4.45,42.55 4.45,37.47 6.22,37.47 X4.4 | 4.57,10.67 4.57,11.18 1.27,14.48 1.27,23.75 4.57,27.05 4.57,30.61 X4.P$2 | 4.7,10.67 X2.3 5.69,8.15 5.71,8.13 9.4,11.81 14.86,11.81 20.45,5.97 | v45.09,28.7 45.09,29.08 45.72,29.72 45.72,33.27 v45.21,33.78 | v55.24,38.86 55.24,37.97 54.48,37.21 54.48,29.34 v55.88,27.94
  Bottom 0.813: v60.83,31.37 60.12,31.37 59.23,30.48 59.18,30.48 56.64,27.94 v55.88,27.94 | 77.47,25.65 77.44,25.68 S1.1 77.42,21.13 90.68,7.87 93.73,7.87 JP5.1 | S1.2 70.92,25.6 70.99,25.53 67.44,21.97 v67.44,18.41 | v38.23,21.21 37.34,21.21 v30.1,13.97
  Bottom 1.016: 20.45,5.97 25.27,5.97 25.78,6.48 36.96,6.48 37.47,6.1
  Bottom 1.27: 37.47,6.1 42.16,6.1 43.18,5.08 POWER.5 | POWER.4 40.64,6.35 40.01,6.35
  other vias: 29.34,40.77 87.5,38.99 87.76,20.95 70.36,35.18 86.49,9.53 22.48,13.97 13.59,13.97 33.91,13.97 8.38,45.21 40.77,21.21
  pour Top (isolate 0.254, rank 2, hatched): 0.64,52.7 101.6,52.7 101.6,0.64 0.64,0.64
  pour Bottom (isolate 0.305, rank 2, hatched): 0.64,52.7 101.6,52.7 102.23,52.07 102.23,0.64 1.27,0.64 0.64,1.27
M8RXD  (via drill 0.41, 0.71)
  Top 0.203: v14.22,33.78 14.1,33.91 14.1,34.8 IC6.1 | R11.P$1 25.27,26.29 v26.42,25.15
  Bottom 0.203: v14.22,33.78 16.13,31.88 19.68,31.88 v26.42,25.15
M8TXD  (via drill 0.41, 0.71)
  Top 0.203: v23.62,25.4 24.77,24.26 R12.P$1 | v18.41,30.35 17.65,31.11 17.65,32.38 16.76,33.27 16.76,34.8 IC6.5
  Bottom 0.203: v23.62,25.4 18.67,30.35 v18.41,30.35
N$2
  Top 0.203: R1.2 25.44,41.24 L.P$1
N$3
  Top 0.203: PWR.P$1 77.22,37.08 79.76,34.54 R8.2
N$4
  Top 0.203: IC7.5 20.32,20.95 18.8,22.48 17.65,22.48 17.65,23.88 17.27,24.26 IC7.1
N$6  (via drill 0.41)
  Top 0.203: Q2.1 43.26,10.79 43.28,10.77 42.16,9.65 C2.2 | IC2.34 48.8,16.54 v47.62,15.37
  Bottom 0.203: Q2.1 43.26,10.79 43.28,10.77 45.92,13.41 45.92,13.72 45.97,13.72 v47.62,15.37
N$7  (via drill 0.41)
  Top 0.203: C3.2 39.62,12.19 43.18,15.75 Q2.2 43.2,15.62 43.28,15.54 43.38,15.65 | IC2.33 48.3,17.82 v46.48,16
  Bottom 0.203: 43.18,15.65 43.08,15.75 | Q2.2 43.18,15.65 | 43.18,15.65 43.28,15.54 45.41,15.54 45.48,15.61 45.47,15.62 45.85,16 v46.48,16
N$15  (via drill 0.41)
  Top 0.203: v23.75,31.88 24.77,31.88 RX.P$2 | v16.38,39.24 17.4,40.39 17.4,42.04 IC6.23
  Bottom 0.203: v16.38,39.24 17.14,39.24 23.75,32.64 v23.75,31.88
N$53  (via drill 0.41)
  Top 0.203: v23.88,34.16 24.77,34.16 TX.P$2 | v19.05,38.61 18.03,39.62 18.03,42.04 IC6.22
  Bottom 0.203: v23.88,34.16 23.37,34.16 23.24,34.29 v19.05,38.61
N$54
  Top 0.203: R7.1 25.44,36.28 26.42,35.31 28.32,35.31 28.57,35.05 28.57,32.26 27.69,31.37 RX.P$1
N$55
  Top 0.203: R9.1 25.44,29.38 26.42,30.35 26.42,33.15 27.43,34.16 TX.P$1
N$60  (via drill 0.71)
  Top 0.508: 19.3,32.26 19.3,32.13
  Top 0.813: v17.78,33.66 19.3,32.26 | 19.3,32.13 F1.2
  Bottom 0.508: X4.1 9.14,36.45
  Bottom 0.813: 9.14,36.45 10.67,34.92 16.64,34.92 v17.78,33.66
PA0
  Top 0.203: IC2.78 55.8,37.89 56.26,38.35 56.26,39.5 55.88,39.88 55.88,42.16 59.94,46.23 90.68,46.23 92.71,48.26 JP1.16
PA1
  Top 0.203: IC2.77 56.3,37.63 56.77,38.1 56.77,39.62 56.39,40.01 56.39,41.91 60.2,45.72 91.44,45.72 92.71,46.99 95.25,46.99 JP1.15
PA2
  Top 0.203: JP1.14 93.09,45.21 60.45,45.21 56.9,41.66 56.9,40.13 57.28,39.75 57.28,37.85 56.8,37.37 IC2.76
PA3
  Top 0.203: IC2.75 58.8,37.72 60.96,39.88 60.96,43.69 61.98,44.7 91.82,44.7 92.08,44.45 95.25,44.45 JP1.13
PA4
  Top 0.203: IC2.74 59.75,33.85 59.94,34.04 59.94,38.23 61.47,39.75 61.47,43.31 62.36,44.2 91.69,44.2 92.71,43.18 JP1.12
PA5
  Top 0.203: IC2.73 60.02,33.35 60.45,33.78 60.45,37.97 62.1,39.62 62.1,42.93 62.87,43.69 90.3,43.69 92.08,41.91 95.25,41.91 JP1.11
PA6
  Top 0.203: IC2.72 60.28,32.85 60.96,33.53 60.96,37.72 62.74,39.5 62.74,42.67 63.25,43.18 89.53,43.18 92.08,40.64 JP1.10
PA7
  Top 0.203: IC2.71 60.54,32.35 61.47,33.27 61.47,37.47 63.37,39.37 63.37,42.29 63.75,42.67 88.14,42.67 91.44,39.37 95.25,39.37 JP1.9
PB0  (via drill 0.41)
  Top 0.203: IC2.19 45.39,25.35 v46.35,24.38 | v49.02,11.81 92.33,11.81 92.71,11.43 95.25,11.43 JP2.1
  Bottom 0.203: v46.35,24.38 46.86,24.38 49.91,21.34 49.91,12.7 v49.02,11.81
PB1  (via drill 0.41)
  Top 0.203: IC2.20 41.19,24.85 v40.89,25.15 | v49.02,10.41 49.15,10.41 50.04,11.3 73.53,11.3 74.04,10.79 v74.04,10.92 74.8,10.92 75.06,11.18 91.69,11.18 92.71,10.16 JP2.2
  Bottom 0.203: v40.89,25.15 44.32,25.15 46.1,23.37 47.12,23.37 49.4,21.08 49.4,13.46 48.13,12.19 48.13,10.92 48.64,10.41 v49.02,10.41 | 64.39,24 64.69,24.36 64.69,27 63.75,27.94
  Bottom 0.254: v74.04,10.92 72.9,10.92 70.99,12.83 65.15,12.83 64.39,13.59 64.39,24 | 63.75,27.94 ICSP.3
PB2  (via drill 0.41)
  Top 0.203: IC2.21 41.24,24.35 41.02,24.13 v39.88,24.13 | v49.02,9.02 50.8,10.79 63.75,10.79 64.01,10.54 73.03,10.54 73.66,9.91 76.33,9.91 v76.45,10.03 77.22,10.03 77.85,10.67 90.93,10.67 92.71,8.89 97.16,8.89 97.79,9.53 97.79,11.43 JP2.3
  Bottom 0.203: v39.88,24.13 41.02,24.13 41.66,24.64 44.2,24.64 45.97,22.86 46.86,22.86 48.9,20.83 48.9,13.72 47.62,12.45 47.62,10.03 48.64,9.02 v49.02,9.02 | ICSP.4 66.42,27.94 67.31,27.05
  Bottom 0.254: 67.31,27.05 67.31,24.77 66.04,23.5 66.04,22.99 65.66,22.61 65.66,14.48 66.04,14.1 71.5,14.1 73.15,12.45 74.8,12.45 76.45,10.79 v76.45,10.03
PB3  (via drill 0.41)
  Top 0.203: IC2.22 44.35,23.85 44.58,23.62 v44.58,22.99 | v49.02,7.75 50.04,8.76 50.04,9.27 51.05,10.29 63.37,10.29 63.75,9.91 72.01,9.91 73.91,8 76.34,8 77.34,9 77.34,9.02 78.23,9.91 80.26,9.91 81.03,9.14 v81.03,8.76
  Bottom 0.203: v81.03,8.76 81.15,8.76 83.44,6.48 85.09,6.48 85.6,5.97 86.87,5.97 87.38,5.46 96.9,5.46 98.04,6.6 98.04,10.54 97.16,11.43 95.25,11.43 JP2.4 | v44.58,22.99 45.09,22.99 45.72,22.35 46.61,22.35 48.39,20.57 48.39,13.97 47.12,12.7 47.12,9.53 48.9,7.75 v49.02,7.75 | 65.1,23.09 65.1,29.01 ICSP.1
  Bottom 0.254: v81.03,8.76 81.03,9.27 80.39,9.91 78.11,9.91 77.34,9.14 75.82,9.14 75.56,9.4 75.56,10.79 74.42,11.94 72.77,11.94 71.25,13.46 65.53,13.46 65.02,13.97 65.02,22.99 65.1,23.09
PB4
  Top 0.203: PWMH.3 36.83,43.94 35.31,42.42 35.31,24.38 36.32,23.37 42.93,23.37 42.9,23.35 IC2.23
PB5
  Top 0.203: IC2.24 36.08,22.85 34.8,24.13 34.8,40.89 34.29,41.4 PWMH.4
PB6
  Top 0.203: PWMH.5 31.75,42.93 34.29,40.39 34.29,23.88 35.81,22.35 42.93,22.35 42.92,22.35 IC2.25
PB7
  Top 0.203: IC2.26 44.22,20.34 44.09,20.22 37.19,20.22 33.78,23.62 33.78,40.13 29.21,44.7 | 29.21,44.7 PWMH.6 | R1.1 27.3,41.66 29.21,43.56 29.21,44.7
PC0
  Top 0.203: IC2.53 62,23.35 62.99,22.35 81.28,22.35 88.14,29.21 95.25,29.21 JP1.1
PC1
  Top 0.203: IC2.54 62.13,23.85 63.12,22.86 80.77,22.86 88.39,30.48 JP1.2
PC2
  Top 0.203: IC2.55 62.27,24.35 63.25,23.37 80.39,23.37 88.77,31.75 95.25,31.75 JP1.3
PC3
  Top 0.203: IC2.56 62.4,24.85 63.37,23.88 79.88,23.88 89.03,33.02 JP1.4
PC4
  Top 0.203: IC2.57 61.8,25.35 62.92,26.47 68.5,26.47 69.22,27.18 82.04,27.18 89.15,34.29 95.25,34.29 JP1.5
PC5
  Top 0.203: IC2.58 61.53,25.85 62.56,26.87 68.15,26.87 69.09,27.81 81.66,27.81 89.41,35.56 JP1.6
PC6
  Top 0.203: IC2.59 61.27,26.35 62.36,27.43 62.36,28.57 62.79,29.01 68.66,29.01 69.22,28.45 81.28,28.45 89.66,36.83 95.25,36.83 JP1.7
PC7
  Top 0.203: IC2.60 61.14,26.85 61.85,27.56 61.85,28.7 62.56,29.41 69.01,29.41 69.47,28.96 80.77,28.96 89.92,38.1 JP1.8
PD7
  Top 0.203: IC2.50 59.05,20.35 59.05,20.34 60.3,21.59 61.34,21.59 61.59,21.84 81.79,21.84 86.74,26.67 88.01,27.94 JP2.16
PE0  (via drill 0.41)
  Top 0.203: PWML.1 61.47,48.77 61.21,48.77 57.53,45.09 47.24,45.09 40.39,38.23 40.39,37.08 v40.64,36.45 41.53,36.45 42.8,35.31 43.69,35.31 43.94,35.05 43.94,34.04 43.75,33.85 IC2.2 | R11.P$2 30.86,26.42 31.11,26.16 v31.5,26.16
  Bottom 0.203: v31.5,26.16 31.75,26.42 33.4,26.42 35.18,28.19 35.18,33.4 37.97,36.45 v40.64,36.45
PE1  (via drill 0.41)
  Top 0.203: v40.39,35.18 39.88,35.69 39.88,38.48 46.99,45.59 57.28,45.59 60.96,49.28 PWML.2 | v39.62,33.53 39.88,33.27 39.95,33.35 IC2.3 | R12.P$2 30.73,23.88 v31.5,24.64
  Bottom 0.203: v40.39,35.18 40.39,34.29 v39.62,33.53 36.58,33.53 35.69,32.64 35.69,28.07 32.26,24.64 v31.5,24.64
PE3  (via drill 0.41)
  Top 0.203: 39.22,32.66 39.37,32.51 | 39.22,32.66 38.86,33.02 38.86,38.99 46.74,46.86 49.15,46.86 v49.4,47.12 | IC2.5 39.54,32.35 39.22,32.66
  Bottom 0.203: v49.4,47.12 49.4,47.62 50.8,49.02 50.8,50.55 50.67,50.67 PWML.6
PE4
  Top 0.203: IC2.6 39.02,31.85 38.35,32.51 38.35,39.24 47.24,48.13 57.53,48.13 58.42,49.02 PWML.3
PE5
  Top 0.203: IC2.7 42.78,31.35 42.55,31.37 38.73,31.37 37.85,32.26 37.85,39.5 46.99,48.64 55.37,48.64 55.88,49.15 PWML.4 55.75,50.93
PG0  (via drill 0.41)
  Top 0.203: IC2.51 58.8,21.84 v59.05,21.46 | v59.05,18.67 60.33,18.67 61.98,20.32 83.82,20.32 87.63,24.13 95.25,24.13 JP2.13
  Bottom 0.203: v59.05,18.67 v59.05,21.46
PG1  (via drill 0.41)
  Top 0.203: IC2.52 60.56,22.85 v60.96,22.48 | v59.94,19.56 60.58,19.56 61.85,20.83 83.06,20.83 86.49,24.13 86.49,24.26 87.63,25.4 JP2.14
  Bottom 0.203: v59.94,19.56 60.58,19.56 61.34,20.32 61.34,22.1 v60.96,22.48
PG2  (via drill 0.41)
  Top 0.203: IC2.70 59.8,31.85 59.92,31.73 59.92,29.23 v60.33,28.83 | v60.58,20.7 61.09,20.7 61.72,21.34 82.55,21.34 86.74,25.53 86.74,25.78 87.63,26.67 95.25,26.67 JP2.15
  Bottom 0.203: v60.58,20.7 60.2,20.7 60.07,20.83 60.07,28.45 v60.33,28.83
PG5  (via drill 0.41)
  Top 0.203: IC2.1 42.73,34.35 42.67,34.29 40.13,34.29 39.37,35.05 39.37,38.73 46.74,46.1 50.16,46.1 v50.93,46.99
  Bottom 0.203: PWML.5 53.34,48.64 52.58,47.88 51.82,47.88 v50.93,46.99
PH3
  Top 0.203: IC2.15 37.42,27.35 37.34,27.43 37.34,39.75 48.39,50.8 | 48.39,50.8 PWML.7 | 48.39,50.8 48.51,50.93
PH4
  Top 0.203: IC2.16 37.16,26.85 36.83,27.18 36.83,40.01 45.72,48.9 45.72,49.53 45.97,49.78 45.97,50.04 45.47,50.55 PWML.8
PH5
  Top 0.203: IC2.17 36.9,26.35 36.32,26.92 36.32,40.13 41.91,45.72 PWMH.1
PH6
  Top 0.203: PWMH.2 39.37,43.94 35.81,40.39 35.81,26.67 36.58,25.91 42.67,25.91 42.73,25.85 IC2.18
PL0
  Top 0.203: 49.28,20.3 49.28,14.22 51.18,12.32 90.17,12.32 91.82,13.97 95.25,13.97 JP2.5
  Top 0.254: IC2.35 49.3,20.32 49.28,20.3
PL1
  Top 0.203: IC2.36 49.8,14.46 51.44,12.83 89.53,12.83 91.95,15.24 JP2.6
PL2
  Top 0.203: 50.29,20.3 50.29,14.99 51.94,13.34 88.9,13.34 92.08,16.51 95.25,16.51 JP2.7
  Top 0.254: IC2.37 50.27,20.32 50.29,20.3
PL3
  Top 0.203: IC2.38 50.8,15.49 52.45,13.84 88.27,13.84 92.2,17.78 JP2.8
PL4
  Top 0.203: 51.31,20.22 51.31,15.75 52.7,14.35 87.63,14.35 92.33,19.05 95.25,19.05 JP2.9
  Top 0.254: IC2.39 51.3,20.28 51.33,20.24 51.31,20.22
PL5
  Top 0.203: IC2.40 51.8,16.02 52.96,14.86 87,14.86 92.46,20.32 JP2.10
PL6
  Top 0.203: 52.32,20.24 52.32,16.51 53.47,15.37 86.49,15.37 92.71,21.59 95.25,21.59 JP2.11
  Top 0.254: IC2.41 52.3,20.32 52.27,20.3 52.32,20.24
PL7
  Top 0.203: IC2.42 52.8,17.05 53.98,15.88 85.72,15.88 92.71,22.86 JP2.12
PWRIN
  Top 1.27: D1.A 16.13,7.24 13.97,7.24 X2.2
RESET  (via drill 0.41, 0.61)
  Top 0.203: 72.39,30.23 75.95,30.23 S1.3 | 25.53,16.89 C11.1 25.4,16.26 | 25.53,18.16 R5.1 | ICSP.5 64.72,24.31 78.92,24.31 80.01,25.4 v80.01,26.04
  Top 0.254: v46.74,8.76 48.64,6.86 49.53,6.86 50.04,7.37 77.22,7.37 v78.61,8.76
  Top 0.305: IC2.30 46.8,19.44 46.28,18.92 41.4,18.92 35.69,13.21 35.69,11.56 35.31,11.18 33.27,11.18 v31.5,9.4 | S1.4 70.97,30.2 70.99,30.23 72.39,30.23
  Top 0.406: 25.53,16.89 25.53,18.16 | C12.2 25.43,19.74 25.48,19.02 R5.1 | POWER.1 33.02,7.87 v31.5,9.4 | v23.88,17.78 25.4,16.26
  Bottom 0.203: S1.3 77.42,30.15 80.01,27.56 v80.01,26.04
  Bottom 0.305: v78.61,8.76 78.11,8.76 77.98,8.64 74.17,8.64 70.61,12.19 64.9,12.19 63.75,13.34 63.75,23.37 | 63.75,23.37 63.75,25.27 ICSP.5 | 63.75,23.37 63.75,23.24
  Bottom 0.406: v23.88,17.78 24,17.65 24,17.14 31.5,9.65 v31.5,9.4 31.88,9.02 46.48,9.02 v46.74,8.76
RI  (via drill 0.41)
  Top 0.203: IC6.6 17.31,36.92 v16.89,37.34
  Bottom 0.203: v16.89,37.34 16.89,36.07 18.8,34.16 18.8,33.4 23.37,28.83 29.84,28.83 29.84,28.96 30.35,29.46 X3.4
RXD1  (via drill 0.41)
  Top 0.203: IC2.45 54.33,20.35 54.36,20.32 54.36,18.29 55.3,17.35 71.96,17.35 v72.64,17.91
  Bottom 0.203: COMMUNICATION.3 81.28,42.8 74.17,35.69 74.17,19.56 v72.64,17.91
RXD2  (via drill 0.41)
  Top 0.203: IC2.12 41.04,28.85 v41.02,28.83
  Bottom 0.203: v41.02,28.83 41.02,30.73 42.67,32.38 42.67,43.94 44.07,45.34 51.05,45.34 51.69,45.97 55.63,45.97 56.26,45.34 60.2,45.34 63.25,48.39 63.96,48.39 64.85,49.28 67.13,49.28 68.02,48.39 73.53,48.39 74.04,48.9 75.82,48.9 76.2,49.28 COMMUNICATION.5
RXD3  (via drill 0.71)
  Top 0.203: COMMUNICATION.7 71.12,49.28 70.1,48.26 67.44,48.26 66.8,47.75 v66.8,47.24 67.06,47.12 | v55.75,29.72 55.75,29.46 56.9,28.32 58.8,28.32 IC2.63
  Bottom 0.203: v66.8,47.24 67.06,47.12 55.75,35.81 55.75,33.27 56.13,32.89 56.26,32.89 56.77,32.38 56.77,31.11 56.39,30.73 56.01,30.73 55.63,30.35 55.63,29.84 v55.75,29.72
SCL  (via drill 0.41)
  Top 0.203: R2.2 79.76,37.08 79.76,37.34 v80.77,38.35 | IC2.43 53.3,17.31 54.23,16.38 74.68,16.38 75.06,16.76 v75.44,16.76
  Bottom 0.203: COMMUNICATION.1 85.98,49.4 85.98,43.56 v80.77,38.35 79.38,38.35 75.44,34.54 v75.44,16.76
SDA  (via drill 0.41)
  Top 0.203: v74.04,17.65 73.28,16.89 54.48,16.89 53.85,17.53 53.85,19.94 53.8,20.04 53.8,20.14 IC2.44 | R3.2 79.63,39.62 79.5,39.75 v78.49,38.73
  Bottom 0.203: v74.04,17.65 74.93,18.67 74.93,35.18 78.36,38.61 | 78.36,38.61 v78.49,38.73 | COMMUNICATION.2 83.82,44.07 78.36,38.61
TXD1  (via drill 0.41)
  Top 0.203: IC2.46 54.8,20.26 54.86,20.19 54.86,18.67 55.63,17.91 60.2,17.91 61.85,19.56 v71.75,19.56
  Bottom 0.203: COMMUNICATION.4 78.74,41.02 73.41,35.69 73.41,20.7 72.39,19.68 71.88,19.68 v71.75,19.56
TXD2  (via drill 0.41)
  Top 0.203: IC2.13 41.81,28.35 41.4,27.94 39.88,27.94 39.5,28.32 v39.5,28.83
  Bottom 0.203: v39.5,28.83 39.5,30.61 42.16,33.27 42.16,44.2 43.94,45.97 51.05,45.97 51.69,46.61 55.88,46.61 56.52,45.97 60.07,45.97 62.99,48.9 63.88,48.9 64.77,49.78 67.21,49.78 68.1,48.9 73.15,48.9 73.53,49.4 73.53,50.67 COMMUNICATION.6
TXD3  (via drill 0.71)
  Top 0.203: COMMUNICATION.8 67.06,50.8 66.17,49.91 66.17,48.13 v65.28,47.24 | IC2.64 58.66,28.85 58.55,28.83 57.66,28.83 57.28,29.21 57.28,30.35 v55.75,31.88
  Bottom 0.203: v65.28,47.24 65.28,46.23 55.24,36.2 55.24,32.51 v55.75,31.88
USBVCC  (via drill 0.71)
  Top 0.61: T2.1 10.16,27.41 10.16,27.43
  Top 0.813: 15.49,27.81 15.49,28.83 F1.1 | 15.49,27.81 15.49,27.05 C14.1 | v14.35,27.81 15.49,27.81 | v12.32,26.67 11.94,26.67 11.3,26.92 T1.2 10.16,27.43
  Bottom 0.813: v14.35,27.81 13.21,26.67 v12.32,26.67
VIN  (via drill 0.71)
  Top 0.61: 11.81,20.07 IC4.3 | R10.2 15.37,16.89 | 15.37,18.16 C5.1 | 15.24,18.8 15.11,19.05
  Top 0.813: 11.81,20.07 IC5.3 12.19,20.19 12.57,19.94 14.07,19.94 14.45,19.56 15.11,19.05 | 15.37,16.89 15.37,18.16 | C5.1 15.24,18.8 | R10.2 15.62,15.62 16.13,15.11 16.13,12.45 D1.C
  Top 1.27: D1.C 18.41,10.41 21.46,10.41 C6.+ 24,8.26 v24.64,7.37
  Bottom 1.27: v24.64,7.37 24.77,7.49 25.15,7.87 43.81,7.87 45.72,5.97 POWER.6
(copper drawn outside any net)
  shapes: Top area x1

### Text on the board
Top: MEGA03
Bottom: MEGA03
tPlace: 9 | 8 | 7 | 6 | 5 | 4 | 3 | 2 | 1 | 0 | 22 | 14 | 15 | 16 | 17 | 18 | 19 | 20 | 21 | 13 | 12 | 11 | 10 | 24 | 26 | 28 | 30 | 31 | 32 | 33 | 34 | 35 | 36 | 37 | 38 | 39 | 40 | 41 | 42 | 43 | 44 | 45 | 46 | 47 | 48 | 49 | 50 | 51 | 52 | 53 | 0 | 1 | 2 | 3 | 4 | 5 | 6 | 7 | 8 | 9 | 10 | 11 | 12 | 13 | 14 | 15
tNames: 5V | GND | AREF | PWM | TX | RX | TX3 | RX3 | TX2 | RX2 | TX1 | RX1 | SDA | SCL | 1 | DIGITAL | ANALOG IN | GND | RESET | 3V3 | 5V | GND | VIN
bNames: designed by | tinker.it
Reference: C7 | C6